# Altium schematic sheet Home_security.schdoc
size 177 x 118 mm
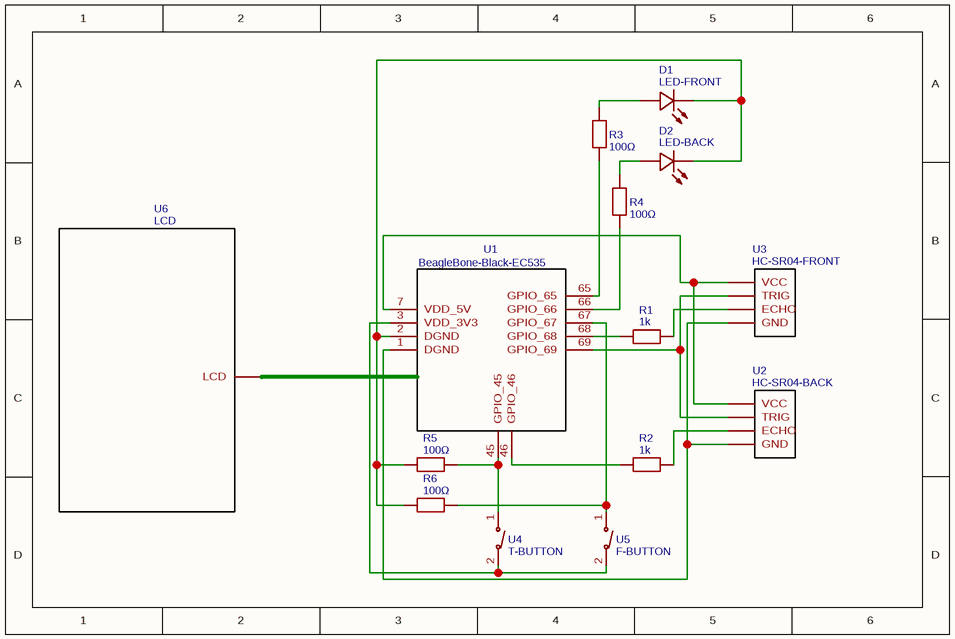
[diagram p0: Home_security.schdoc]

## Parts
D1  LED-FRONT  [LED0805-RD]
D2  LED-BACK  [LED0805-RD]
R1  1k  [R2010]
R2  1k  [R2010]
R3  100Ω  [R2010]
R4  100Ω  [R2010]
R5  100Ω  [R2010]
R6  100Ω  [R2010]
U1  BeagleBone-Black-EC535
U2  HC-SR04-BACK
U3  HC-SR04-FRONT
U4  T-BUTTON  [KEY-SMD_L6.0-W6.0-LS6.6]
U5  F-BUTTON  [KEY-SMD_L6.0-W6.0-LS6.6]
U6  LCD

## Nets
NetD1_1: D1.1(-) D2.1(-) R5.1 R6.1 U1.2(DGND)
NetD1_2: D1.2(+) R3.2
NetD2_2: D2.2(+) R4.1
NetR1_1: R1.1 U1.68(GPIO_68)
NetR1_2: R1.2 U3.3(ECHO)
NetR2_1: R2.1 U1.46(GPIO_46)
NetR2_2: R2.2 U2.3(ECHO)
NetR3_1: R3.1 U1.65(GPIO_65)
NetR4_2: R4.2 U1.66(GPIO_66)
NetR5_2: R5.2 U1.45(GPIO_45) U4.1(A)
NetR6_2: R6.2 U1.67(GPIO_67) U5.1(A)
NetU1_1: U1.1(DGND) U2.4(GND) U3.4(GND)
NetU1_3: U1.3(VDD_3V3) U4.2(B) U5.2(B)
NetU1_7: U1.7(VDD_5V) U2.1(VCC) U3.1(VCC)
NetU1_69: U1.69(GPIO_69) U2.6(TRIG) U3.6(TRIG)

Not connected (* = marked no-connect by the designer): U6 1(LCD)

## Library data of the parts
D1 = LED-FRONT: BOM_Manufacturer: null; BOM_Manufacturer Part: LED-DIODE_2; Contributor: LCSC; BOM_Supplier: LCSC; BOM_Supplier Part: C9900003436; BOM_JLCPCB Part Class: Extended Part; spicePre: D; spiceSymbolName: LED-DIODE_2
D2 = LED-BACK: BOM_Manufacturer: null; BOM_Manufacturer Part: LED-DIODE_2; Contributor: LCSC; BOM_Supplier: LCSC; BOM_Supplier Part: C9900003436; BOM_JLCPCB Part Class: Extended Part; spicePre: D; spiceSymbolName: LED-DIODE_2
R1 R2 = 1k: BOM_Manufacturer: UNI-ROYAL(厚声); BOM_Manufacturer Part: 201007F6804T4E; Resistance (Ohms): 6.8M; nameAlias: Resistance; Contributor: LCSC; BOM_Supplier: LCSC; BOM_Supplier Part: C421792; BOM_JLCPCB Part Class: Extended Part; spicePre: R; spiceSymbolName: 201007F6804T4E
R3-R6 = 100Ω: BOM_Manufacturer: UNI-ROYAL(厚声); BOM_Manufacturer Part: 201007F6804T4E; Resistance (Ohms): 6.8M; nameAlias: Resistance; Contributor: LCSC; BOM_Supplier: LCSC; BOM_Supplier Part: C421792; BOM_JLCPCB Part Class: Extended Part; spicePre: R; spiceSymbolName: 201007F6804T4E
U1 = BeagleBone-Black-EC535: Contributor: csc0007; spicePre: U; spiceSymbolName: BeagleBone-Black-EC535
U2 = HC-SR04-BACK: Contributor: csc0007; spicePre: U; spiceSymbolName: HC-SR04
U3 = HC-SR04-FRONT: Contributor: csc0007; spicePre: U; spiceSymbolName: HC-SR04
U4 = T-BUTTON: BOM_Manufacturer: null; BOM_Manufacturer Part: BUTTON; Contributor: lcsc; BOM_Supplier: LCSC; BOM_Supplier Part: C9900040040; BOM_JLCPCB Part Class: Extended Part; spicePre: U; spiceSymbolName: BUTTON_C9900040040
U5 = F-BUTTON: BOM_Manufacturer: null; BOM_Manufacturer Part: BUTTON; Contributor: lcsc; BOM_Supplier: LCSC; BOM_Supplier Part: C9900040040; BOM_JLCPCB Part Class: Extended Part; spicePre: U; spiceSymbolName: BUTTON_C9900040040
U6 = LCD: Contributor: csc0007; spicePre: U; spiceSymbolName: LCD